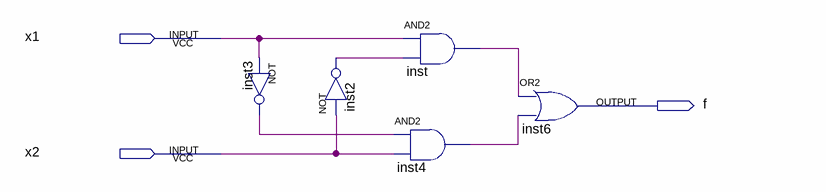
[diagram p0: schematic sheet]
// Quartus schematic Block2.bdf as structural Verilog: 5 symbols, 3 pins
module Block2 (
  input  x1,
  input  x2,
  output f
);

  wire inst2_out, inst3_out, inst4_out, inst_out;

  not inst3 (inst3_out, x1);
  not inst2 (inst2_out, x2);
  and inst4 (inst4_out, inst3_out, x2);
  and inst (inst_out, x1, inst2_out);
  or inst6 (f, inst_out, inst4_out);
endmodule
